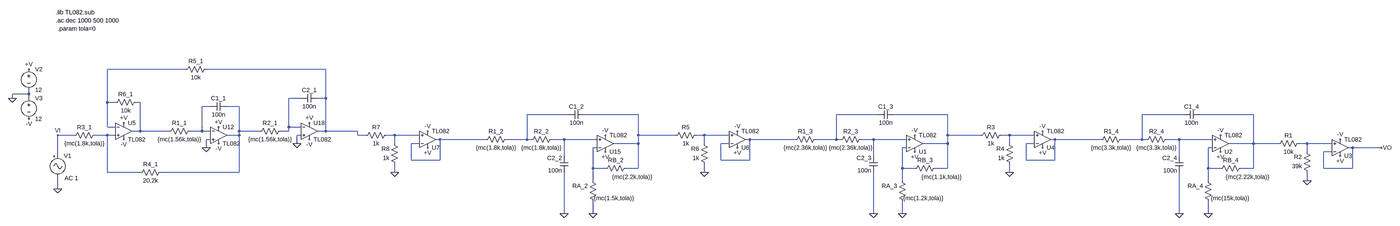
[diagram p0: schematic FiltroLP_R.asc, whole sheet]
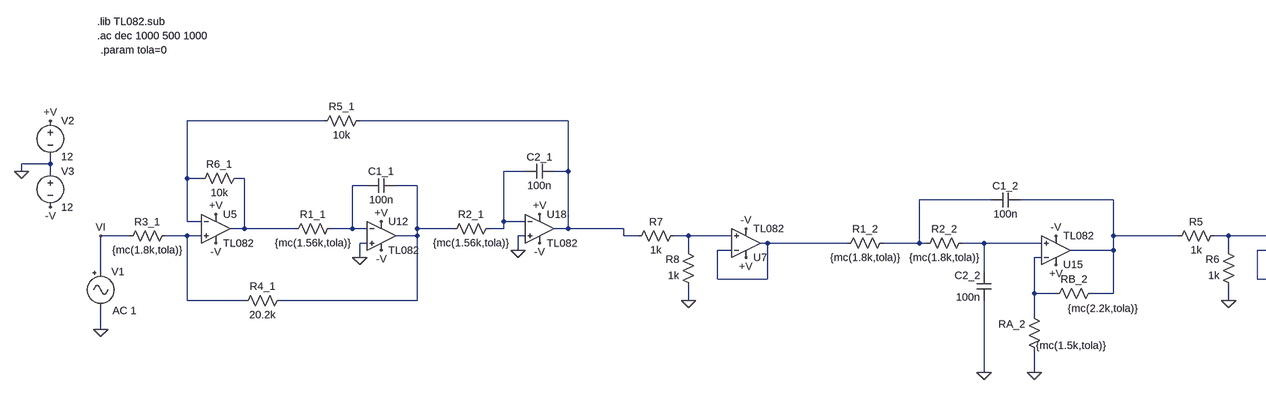
[diagram p1: schematic FiltroLP_R.asc, part, row 1 of 1, column 1 of 2]
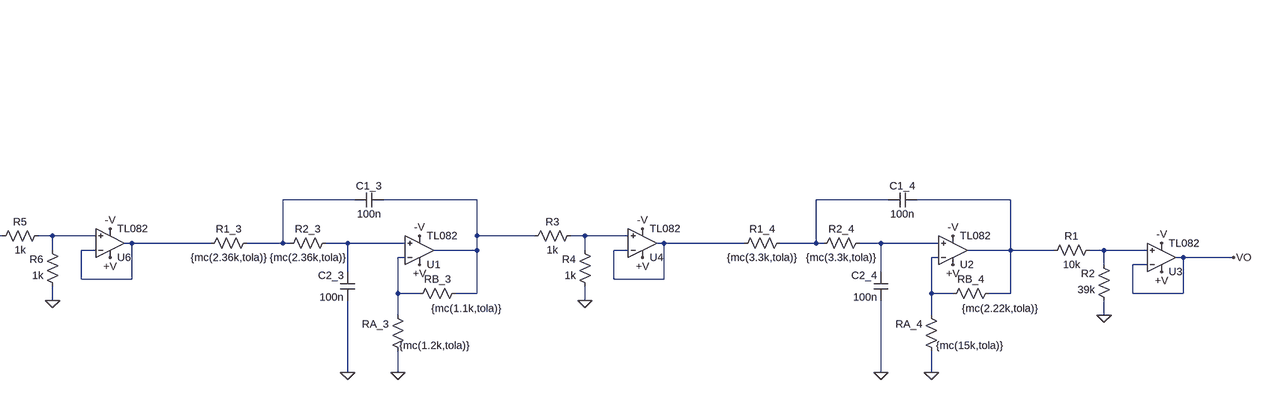
[diagram p2: schematic FiltroLP_R.asc, part, row 1 of 1, column 2 of 2]
FiltroLP_R.asc, the LTspice schematic file:
Version 4
SHEET 1 5208 1092
WIRE -912 0 -1216 0
WIRE -368 0 -832 0
WIRE -1520 96 -1520 80
WIRE -1520 96 -1584 96
WIRE -1584 112 -1584 96
WIRE -1520 112 -1520 96
WIRE -464 112 -512 112
WIRE -368 112 -368 0
WIRE -368 112 -400 112
WIRE -1216 128 -1216 0
WIRE -1184 128 -1216 128
WIRE -1088 128 -1104 128
WIRE -816 144 -848 144
WIRE -704 144 -752 144
WIRE 624 176 464 176
WIRE 896 176 688 176
WIRE 1824 176 1664 176
WIRE 2096 176 1888 176
WIRE 3072 176 2912 176
WIRE 3344 176 3136 176
WIRE -1216 224 -1216 128
WIRE -1184 224 -1216 224
WIRE -512 224 -512 112
WIRE -464 224 -512 224
WIRE -1088 240 -1088 128
WIRE -1088 240 -1120 240
WIRE -976 240 -1088 240
WIRE -848 240 -848 144
WIRE -848 240 -896 240
WIRE -816 240 -848 240
WIRE -704 240 -704 144
WIRE -624 240 -704 240
WIRE -512 240 -512 224
WIRE -512 240 -544 240
WIRE -368 240 -368 112
WIRE -368 240 -400 240
WIRE -240 240 -368 240
WIRE -1344 256 -1408 256
WIRE -1216 256 -1264 256
WIRE -1184 256 -1216 256
WIRE -704 256 -704 240
WIRE -704 256 -752 256
WIRE -464 256 -480 256
WIRE -240 256 -240 240
WIRE -208 256 -240 256
WIRE -96 256 -128 256
WIRE 0 256 -96 256
WIRE 896 256 896 176
WIRE 1040 256 896 256
WIRE 1152 256 1120 256
WIRE 1248 256 1152 256
WIRE 2096 256 2096 176
WIRE 2224 256 2096 256
WIRE 2336 256 2304 256
WIRE 2432 256 2336 256
WIRE -816 272 -832 272
WIRE 80 272 64 272
WIRE 304 272 80 272
WIRE 464 272 464 176
WIRE 464 272 384 272
WIRE 480 272 464 272
WIRE 608 272 560 272
WIRE 736 272 608 272
WIRE 1328 272 1312 272
WIRE 1504 272 1328 272
WIRE 1664 272 1664 176
WIRE 1664 272 1584 272
WIRE 1680 272 1664 272
WIRE 1808 272 1760 272
WIRE 1936 272 1808 272
WIRE 2512 272 2496 272
WIRE 2752 272 2512 272
WIRE 2912 272 2912 176
WIRE 2912 272 2832 272
WIRE 2928 272 2912 272
WIRE 3056 272 3008 272
WIRE 3184 272 3056 272
WIRE -480 288 -480 256
WIRE -96 288 -96 256
WIRE 0 288 -32 288
WIRE 896 288 896 256
WIRE 896 288 800 288
WIRE 1152 288 1152 256
WIRE 1248 288 1216 288
WIRE 2096 288 2096 256
WIRE 2096 288 2000 288
WIRE 2336 288 2336 256
WIRE 2432 288 2400 288
WIRE 3344 288 3344 176
WIRE 3344 288 3248 288
WIRE 3440 288 3344 288
WIRE 3552 288 3520 288
WIRE 3648 288 3552 288
WIRE -832 304 -832 272
WIRE 736 304 720 304
WIRE 1936 304 1920 304
WIRE 3184 304 3168 304
WIRE 3728 304 3712 304
WIRE 3840 304 3728 304
WIRE 3552 320 3552 288
WIRE 3648 320 3616 320
WIRE -1408 336 -1408 256
WIRE 608 336 608 272
WIRE 1808 336 1808 272
WIRE 3056 336 3056 272
WIRE -32 352 -32 288
WIRE 80 352 80 272
WIRE 80 352 -32 352
WIRE 1216 352 1216 288
WIRE 1328 352 1328 272
WIRE 1328 352 1216 352
WIRE 2400 352 2400 288
WIRE 2512 352 2512 272
WIRE 2512 352 2400 352
WIRE 720 384 720 304
WIRE 768 384 720 384
WIRE 896 384 896 288
WIRE 896 384 848 384
WIRE 1920 384 1920 304
WIRE 1968 384 1920 384
WIRE 2096 384 2096 288
WIRE 2096 384 2048 384
WIRE 3168 384 3168 304
WIRE 3216 384 3168 384
WIRE 3344 384 3344 288
WIRE 3344 384 3296 384
WIRE 3616 384 3616 320
WIRE 3728 384 3728 304
WIRE 3728 384 3616 384
WIRE -1216 400 -1216 256
WIRE -1088 400 -1216 400
WIRE -704 400 -704 256
WIRE -704 400 -1008 400
WIRE -96 400 -96 368
WIRE 1152 400 1152 368
WIRE 2336 400 2336 368
WIRE 720 432 720 384
WIRE 1920 432 1920 384
WIRE 3168 432 3168 384
WIRE 3552 432 3552 400
WIRE -1408 464 -1408 416
WIRE 608 560 608 400
WIRE 720 560 720 512
WIRE 1808 560 1808 400
WIRE 1920 560 1920 512
WIRE 3056 560 3056 400
WIRE 3168 560 3168 512
FLAG 608 560 0
FLAG 720 560 0
FLAG -1408 256 VI
FLAG -1408 464 0
FLAG -832 304 0
FLAG -480 288 0
FLAG -1584 112 0
FLAG -1520 0 +V
FLAG -1520 192 -V
FLAG -1152 208 +V
FLAG -784 224 +V
FLAG -432 208 +V
FLAG -1152 272 -V
FLAG -784 288 -V
FLAG -432 272 -V
FLAG 768 320 +V
FLAG 768 256 -V
FLAG 1808 560 0
FLAG 1920 560 0
FLAG 1968 320 +V
FLAG 1968 256 -V
FLAG 3056 560 0
FLAG 3168 560 0
FLAG 3216 320 +V
FLAG 3216 256 -V
FLAG 3680 272 -V
FLAG 3680 336 +V
FLAG 3552 432 0
FLAG 3840 304 VO
FLAG 2464 240 -V
FLAG 2464 304 +V
FLAG 2336 400 0
FLAG 1280 240 -V
FLAG 1280 304 +V
FLAG 1152 400 0
FLAG 32 240 -V
FLAG 32 304 +V
FLAG -96 400 0
SYMBOL cap 688 160 R90
WINDOW 0 0 32 VBottom 2
WINDOW 3 32 32 VTop 2
SYMATTR InstName C1_2
SYMATTR Value 100n
SYMBOL cap 624 400 R180
WINDOW 0 24 56 Left 2
WINDOW 3 24 8 Left 2
SYMATTR InstName C2_2
SYMATTR Value 100n
SYMBOL res 288 288 R270
WINDOW 3 0 56 VBottom 2
WINDOW 0 32 56 VTop 2
SYMATTR Value {mc(1.8k,tola)}
SYMATTR InstName R1_2
SYMBOL res 864 368 R90
WINDOW 0 0 56 VBottom 2
WINDOW 3 34 -9 VTop 2
SYMATTR InstName RB_2
SYMATTR Value {mc(2.2k,tola)}
SYMBOL res 736 528 R180
WINDOW 0 36 76 Left 2
WINDOW 3 -144 28 Left 2
SYMATTR InstName RA_2
SYMATTR Value {mc(1.5k,tola)}
SYMBOL res 464 288 R270
WINDOW 0 32 56 VTop 2
WINDOW 3 0 56 VBottom 2
SYMATTR InstName R2_2
SYMATTR Value {mc(1.8k,tola)}
SYMBOL Misc\\signal -1408 320 R0
WINDOW 123 26 102 Left 2
WINDOW 39 0 0 Left 2
SYMATTR Value2 AC 1
SYMATTR InstName V1
SYMATTR Value ""
SYMBOL res -1088 112 R90
WINDOW 0 0 56 VBottom 2
WINDOW 3 32 56 VTop 2
SYMATTR InstName R6_1
SYMATTR Value 10k
SYMBOL res -1248 240 R90
WINDOW 0 0 56 VBottom 2
WINDOW 3 32 56 VTop 2
SYMATTR InstName R3_1
SYMATTR Value {mc(1.8k,tola)}
SYMBOL res -880 224 R90
WINDOW 0 0 56 VBottom 2
WINDOW 3 32 56 VTop 2
SYMATTR InstName R1_1
SYMATTR Value {mc(1.56k,tola)}
SYMBOL cap -752 128 R90
WINDOW 0 0 32 VBottom 2
WINDOW 3 32 32 VTop 2
SYMATTR InstName C1_1
SYMATTR Value 100n
SYMBOL cap -400 96 R90
WINDOW 0 0 32 VBottom 2
WINDOW 3 32 32 VTop 2
SYMATTR InstName C2_1
SYMATTR Value 100n
SYMBOL res -528 224 R90
WINDOW 0 0 56 VBottom 2
WINDOW 3 32 56 VTop 2
SYMATTR InstName R2_1
SYMATTR Value {mc(1.56k,tola)}
SYMBOL res -992 384 R90
WINDOW 0 0 56 VBottom 2
WINDOW 3 32 56 VTop 2
SYMATTR InstName R4_1
SYMATTR Value 20.2k
SYMBOL res -816 -16 R90
WINDOW 0 0 56 VBottom 2
WINDOW 3 32 56 VTop 2
SYMATTR InstName R5_1
SYMATTR Value 10k
SYMBOL Opamps\\opamp2 -1152 176 R0
SYMATTR InstName U5
SYMATTR Value TL082
SYMBOL Opamps\\opamp2 -784 192 R0
SYMATTR InstName U12
SYMATTR Value TL082
SYMBOL Opamps\\opamp2 -432 176 R0
SYMATTR InstName U18
SYMATTR Value TL082
SYMBOL voltage -1520 -16 R0
WINDOW 123 0 0 Left 2
WINDOW 39 0 0 Left 2
SYMATTR InstName V2
SYMATTR Value 12
SYMBOL voltage -1520 96 R0
WINDOW 123 0 0 Left 2
WINDOW 39 0 0 Left 2
SYMATTR InstName V3
SYMATTR Value 12
SYMBOL Opamps\\opamp2 768 352 M180
SYMATTR InstName U15
SYMATTR Value TL082
SYMBOL cap 1888 160 R90
WINDOW 0 0 32 VBottom 2
WINDOW 3 32 32 VTop 2
SYMATTR InstName C1_3
SYMATTR Value 100n
SYMBOL cap 1824 400 R180
WINDOW 0 24 56 Left 2
WINDOW 3 24 8 Left 2
SYMATTR InstName C2_3
SYMATTR Value 100n
SYMBOL res 1488 288 R270
WINDOW 3 0 56 VBottom 2
WINDOW 0 32 56 VTop 2
SYMATTR Value {mc(2.36k,tola)}
SYMATTR InstName R1_3
SYMBOL res 2064 368 R90
WINDOW 0 0 56 VBottom 2
WINDOW 3 34 -9 VTop 2
SYMATTR InstName RB_3
SYMATTR Value {mc(1.1k,tola)}
SYMBOL res 1936 528 R180
WINDOW 0 36 76 Left 2
WINDOW 3 -144 28 Left 2
SYMATTR InstName RA_3
SYMATTR Value {mc(1.2k,tola)}
SYMBOL res 1664 288 R270
WINDOW 0 32 56 VTop 2
WINDOW 3 0 56 VBottom 2
SYMATTR InstName R2_3
SYMATTR Value {mc(2.36k,tola)}
SYMBOL Opamps\\opamp2 1968 352 M180
SYMATTR InstName U1
SYMATTR Value TL082
SYMBOL cap 3136 160 R90
WINDOW 0 0 32 VBottom 2
WINDOW 3 32 32 VTop 2
SYMATTR InstName C1_4
SYMATTR Value 100n
SYMBOL cap 3072 400 R180
WINDOW 0 24 56 Left 2
WINDOW 3 24 8 Left 2
SYMATTR InstName C2_4
SYMATTR Value 100n
SYMBOL res 2736 288 R270
WINDOW 3 0 56 VBottom 2
WINDOW 0 32 56 VTop 2
SYMATTR Value {mc(3.3k,tola)}
SYMATTR InstName R1_4
SYMBOL res 3312 368 R90
WINDOW 0 0 56 VBottom 2
WINDOW 3 34 -9 VTop 2
SYMATTR InstName RB_4
SYMATTR Value {mc(2.22k,tola)}
SYMBOL res 3184 528 R180
WINDOW 0 36 76 Left 2
WINDOW 3 -144 28 Left 2
SYMATTR InstName RA_4
SYMATTR Value {mc(15k,tola)}
SYMBOL res 2912 288 R270
WINDOW 0 32 56 VTop 2
WINDOW 3 0 56 VBottom 2
SYMATTR InstName R2_4
SYMATTR Value {mc(3.3k,tola)}
SYMBOL Opamps\\opamp2 3216 352 M180
SYMATTR InstName U2
SYMATTR Value TL082
SYMBOL Opamps\\opamp2 3680 368 M180
SYMATTR InstName U3
SYMATTR Value TL082
SYMBOL res 3536 272 R90
WINDOW 0 0 56 VBottom 2
WINDOW 3 32 56 VTop 2
SYMATTR InstName R1
SYMATTR Value 10k
SYMBOL res 3568 416 R180
WINDOW 0 36 76 Left 2
WINDOW 3 36 40 Left 2
SYMATTR InstName R2
SYMATTR Value 39k
SYMBOL Opamps\\opamp2 2464 336 M180
SYMATTR InstName U4
SYMATTR Value TL082
SYMBOL res 2320 240 R90
WINDOW 0 0 56 VBottom 2
WINDOW 3 32 56 VTop 2
SYMATTR InstName R3
SYMATTR Value 1k
SYMBOL res 2352 384 R180
WINDOW 0 36 76 Left 2
WINDOW 3 36 40 Left 2
SYMATTR InstName R4
SYMATTR Value 1k
SYMBOL Opamps\\opamp2 1280 336 M180
SYMATTR InstName U6
SYMATTR Value TL082
SYMBOL res 1136 240 R90
WINDOW 0 0 56 VBottom 2
WINDOW 3 32 56 VTop 2
SYMATTR InstName R5
SYMATTR Value 1k
SYMBOL res 1168 384 R180
WINDOW 0 36 76 Left 2
WINDOW 3 36 40 Left 2
SYMATTR InstName R6
SYMATTR Value 1k
SYMBOL Opamps\\opamp2 32 336 M180
SYMATTR InstName U7
SYMATTR Value TL082
SYMBOL res -112 240 R90
WINDOW 0 0 56 VBottom 2
WINDOW 3 32 56 VTop 2
SYMATTR InstName R7
SYMATTR Value 1k
SYMBOL res -80 384 R180
WINDOW 0 36 76 Left 2
WINDOW 3 36 40 Left 2
SYMATTR InstName R8
SYMATTR Value 1k
TEXT -1416 -256 Left 2 !.ac dec 1000 500 1000
TEXT -1416 -288 Left 2 !.lib TL082.sub
TEXT -1408 -224 Left 2 !.param tola=0

The netlist it stands for:
* FiltroLP_R.asc
C1_2 N008 N007 100n
C2_2 0 N018 100n
R1_2 N017 N007 {mc(1.8k,tola)}
RB_2 N008 N024 {mc(2.2k,tola)}
RA_2 0 N024 {mc(1.5k,tola)}
R2_2 N007 N018 {mc(1.8k,tola)}
V1 VI 0 AC 1
R6_1 N004 N001 10k
R3_1 N013 VI {mc(1.8k,tola)}
R1_1 N005 N004 {mc(1.56k,tola)}
C1_1 N006 N005 100n
C2_1 N002 N003 100n
R2_1 N003 N006 {mc(1.56k,tola)}
R4_1 N006 N013 20.2k
R5_1 N002 N001 10k
XU5 N013 N001 +V -V N004 TL082  ; pins In+ In- V+ V- OUT
XU12 0 N005 +V -V N006 TL082  ; pins In+ In- V+ V- OUT
XU18 0 N003 +V -V N002 TL082  ; pins In+ In- V+ V- OUT
V2 +V 0 12
V3 0 -V 12
XU15 N018 N024 +V -V N008 TL082  ; pins In+ In- V+ V- OUT
C1_3 N010 N009 100n
C2_3 0 N020 100n
R1_3 N019 N009 {mc(2.36k,tola)}
RB_3 N010 N025 {mc(1.1k,tola)}
RA_3 0 N025 {mc(1.2k,tola)}
R2_3 N009 N020 {mc(2.36k,tola)}
XU1 N020 N025 +V -V N010 TL082  ; pins In+ In- V+ V- OUT
C1_4 N012 N011 100n
C2_4 0 N022 100n
R1_4 N021 N011 {mc(3.3k,tola)}
RB_4 N012 N026 {mc(2.22k,tola)}
RA_4 0 N026 {mc(15k,tola)}
R2_4 N011 N022 {mc(3.3k,tola)}
XU2 N022 N026 +V -V N012 TL082  ; pins In+ In- V+ V- OUT
XU3 N023 VO +V -V VO TL082  ; pins In+ In- V+ V- OUT
R1 N023 N012 10k
R2 0 N023 39k
XU4 N016 N021 +V -V N021 TL082  ; pins In+ In- V+ V- OUT
R3 N016 N010 1k
R4 0 N016 1k
XU6 N015 N019 +V -V N019 TL082  ; pins In+ In- V+ V- OUT
R5 N015 N008 1k
R6 0 N015 1k
XU7 N014 N017 +V -V N017 TL082  ; pins In+ In- V+ V- OUT
R7 N014 N002 1k
R8 0 N014 1k
.ac dec 1000 500 1000
.lib TL082.sub
.param tola=0
.backanno
.end